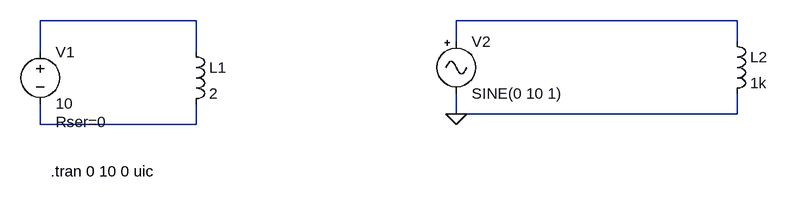
[diagram p0: schematic Inductor_test.asc]
Inductor_test.asc, the LTspice schematic file:
Version 4.1
SHEET 1 1272 680
WIRE 352 160 112 160
WIRE 1184 160 752 160
WIRE 752 192 752 160
WIRE 1184 192 1184 160
WIRE 112 208 112 160
WIRE 352 208 352 160
WIRE 752 304 752 272
WIRE 1184 304 1184 272
WIRE 1184 304 752 304
WIRE 112 320 112 288
WIRE 352 320 352 288
WIRE 352 320 112 320
FLAG 752 304 0
SYMBOL voltage 112 192 R0
WINDOW 123 0 0 Left 0
WINDOW 39 24 124 Left 2
SYMATTR SpiceLine Rser=0
SYMATTR InstName V1
SYMATTR Value 10
SYMBOL ind 336 192 R0
SYMATTR InstName L1
SYMATTR Value 2
SYMATTR SpiceLine Ipk=1000 Rser=1 Rpar=1T Cpar=0
SYMBOL Misc\\signal 752 176 R0
WINDOW 123 0 0 Left 0
WINDOW 39 0 0 Left 0
SYMATTR InstName V2
SYMATTR Value SINE(0 10 1)
SYMBOL ind 1168 176 R0
SYMATTR InstName L2
SYMATTR Value 1k
SYMATTR SpiceLine Rser=1m
TEXT 128 392 Left 2 !.tran 0 10 0 uic

The netlist it stands for:
* Inductor_test.asc
V1 N001 N003 10 Rser=0
L1 N001 N003 2 Ipk=1000 Rser=1 Rpar=1T Cpar=0
V2 N002 0 SINE(0 10 1)
L2 N002 0 1k Rser=1m
.tran 0 10 0 uic
.backanno
.end